# Altium schematic sheet 把手锁设置板20326.SchDoc
size A4
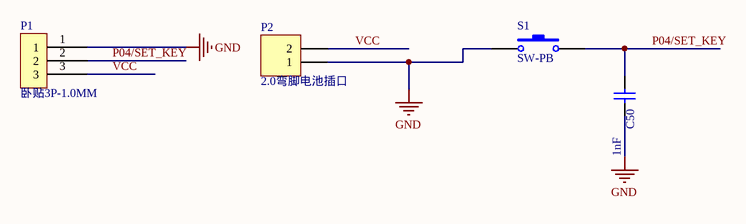
[diagram p0: 把手锁设置板20326.SchDoc]

## Parts
C50  1nF  [0603C]
P1  卧贴3P-1.0MM  [3P-2.54MM]
P2  2.0弯脚电池插口  [S2B-PH]
S1  SW-PB  [6*6H9]

## Nets
GND: C50.2 P1.1 P2.1 S1.1
P04/SET_KEY: C50.1 P1.2 S1.2
VCC: P1.3 P2.2

## Library data of the parts
C50 = CAP-NP: Capacitor, Ceramic; Capacitance: 18 pF; Dielectric: COG; Polarity: Non-Polarized; Rated Voltage: 50 mV; Tolerance: 5 %; Category: Capacitor; Mounting Technology: Surface Mount; Status: Unreleased; Technology: Ceramic
P1 = 3P
P2 = Header 2: Header, 2-Pin; LatestRevisionDate: 17-Jul-2002; LatestRevisionNote: Re-released for DXP Platform.; Publisher: Altium Limited
S1 = SW-PB: Switch; Published: 24-Mar-1999; LatestRevisionDate: 17-Jul-2002; LatestRevisionNote: Re-released for DXP Platform.; PackageReference: SPST-2; Publisher: Altium Limited; PackageDescription: Switch; 2 Leads